# EAGLE design BlinkyTile (EAGLE 7.1.0)
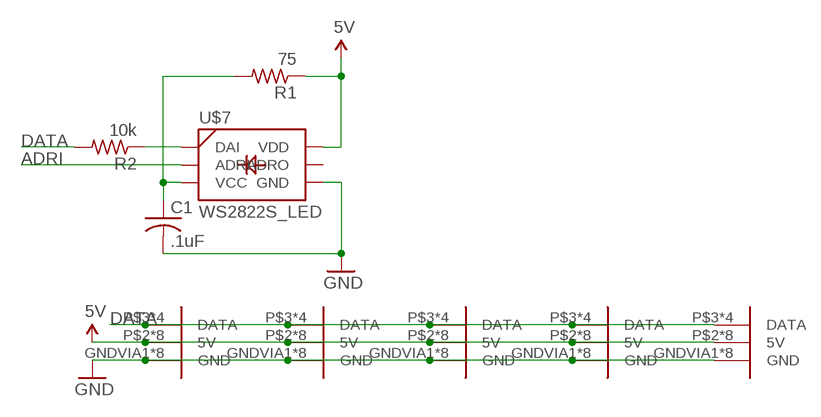
[diagram p0: schematic, sheet 1]

## Parts
C1  .1uF  C-USC0603  [C0603]
R1  75  R-US_R0603  [R0603]
R2  10k  R-US_R0603  [R0603]
U$2  D_EDGEMOD  [D_EDGE_SLOT_MOD]
U$3  D_EDGEMOD  [D_EDGE_SLOT_MOD]
U$4  D_EDGEMOD  [D_EDGE_SLOT_MOD]
U$5  D_EDGEMOD  [D_EDGE_SLOT_MOD]
U$6  D_EDGEMOD  [D_EDGE_SLOT_MOD]
U$7  WS2822S_LED  [WS2822S_LED]

## Nets
5V: R1.1 U$2.P$2(5V) U$2.P$4(5V) U$2.P$7(5V) U$2.P$9(5V) U$2.PWRVIA1(5V) U$2.PWRVIA3(5V) U$2.PWRVIA4(5V) U$2.PWRVIA6(5V) U$3.P$2(5V) U$3.P$4(5V) U$3.P$7(5V) U$3.P$9(5V) U$3.PWRVIA1(5V) U$3.PWRVIA3(5V) U$3.PWRVIA4(5V) U$3.PWRVIA6(5V) U$4.P$2(5V) U$4.P$4(5V) U$4.P$7(5V) U$4.P$9(5V) U$4.PWRVIA1(5V) U$4.PWRVIA3(5V) U$4.PWRVIA4(5V) U$4.PWRVIA6(5V) U$5.P$2(5V) U$5.P$4(5V) U$5.P$7(5V) U$5.P$9(5V) U$5.PWRVIA1(5V) U$5.PWRVIA3(5V) U$5.PWRVIA4(5V) U$5.PWRVIA6(5V) U$6.P$2(5V) U$6.P$4(5V) U$6.P$7(5V) U$6.P$9(5V) U$6.PWRVIA1(5V) U$6.PWRVIA3(5V) U$6.PWRVIA4(5V) U$6.PWRVIA6(5V) U$7.6(VDD)
ADRI: U$7.2(ADRI)
DATA: R2.2 U$2.P$3(DATA) U$2.P$8(DATA) U$2.SIGVIA1(DATA) U$2.SIGVIA3(DATA) U$3.P$3(DATA) U$3.P$8(DATA) U$3.SIGVIA1(DATA) U$3.SIGVIA3(DATA) U$4.P$3(DATA) U$4.P$8(DATA) U$4.SIGVIA1(DATA) U$4.SIGVIA3(DATA) U$5.P$3(DATA) U$5.P$8(DATA) U$5.SIGVIA1(DATA) U$5.SIGVIA3(DATA) U$6.P$3(DATA) U$6.P$8(DATA) U$6.SIGVIA1(DATA) U$6.SIGVIA3(DATA)
GND: C1.2 U$2.GNDVIA1(GND) U$2.GNDVIA3(GND) U$2.GNDVIA4(GND) U$2.GNDVIA6(GND) U$2.P$1(GND) U$2.P$5(GND) U$2.P$6(GND) U$2.P$10(GND) U$3.GNDVIA1(GND) U$3.GNDVIA3(GND) U$3.GNDVIA4(GND) U$3.GNDVIA6(GND) U$3.P$1(GND) U$3.P$5(GND) U$3.P$6(GND) U$3.P$10(GND) U$4.GNDVIA1(GND) U$4.GNDVIA3(GND) U$4.GNDVIA4(GND) U$4.GNDVIA6(GND) U$4.P$1(GND) U$4.P$5(GND) U$4.P$6(GND) U$4.P$10(GND) U$5.GNDVIA1(GND) U$5.GNDVIA3(GND) U$5.GNDVIA4(GND) U$5.GNDVIA6(GND) U$5.P$1(GND) U$5.P$5(GND) U$5.P$6(GND) U$5.P$10(GND) U$6.GNDVIA1(GND) U$6.GNDVIA3(GND) U$6.GNDVIA4(GND) U$6.GNDVIA6(GND) U$6.P$1(GND) U$6.P$5(GND) U$6.P$6(GND) U$6.P$10(GND) U$7.4(GND)
N$1: C1.1 R1.2 U$7.3(VCC)
N$2: R2.1 U$7.1(DAI)
Unconnected: U$7.5(ADRO)

## Library data of the parts
C1 = adafruit:C-US: CAPACITOR, American symbol
R1 R2 = adafruit:R-US_: RESISTOR, American symbol
U$2-U$6 = dodocohedreled:D_EDGE
U$7 = blinkinlabs:WS2822S_LED

## Board
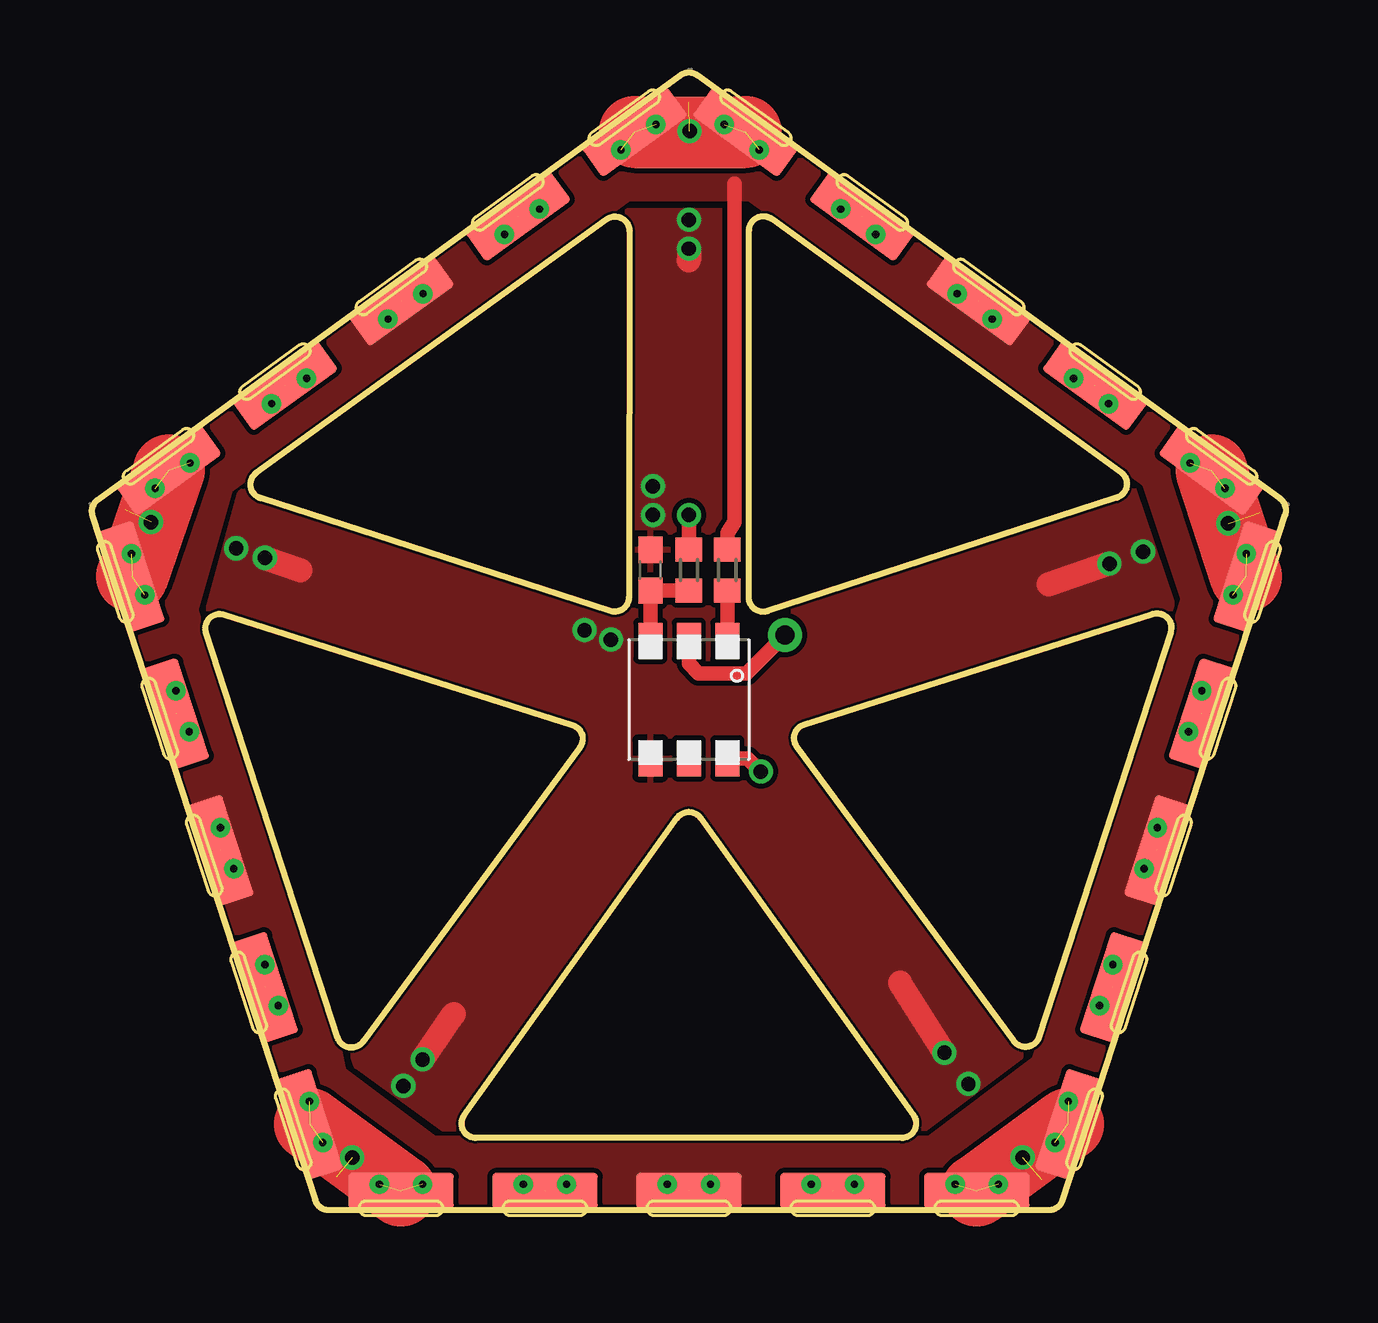
[diagram p1: board, top side]
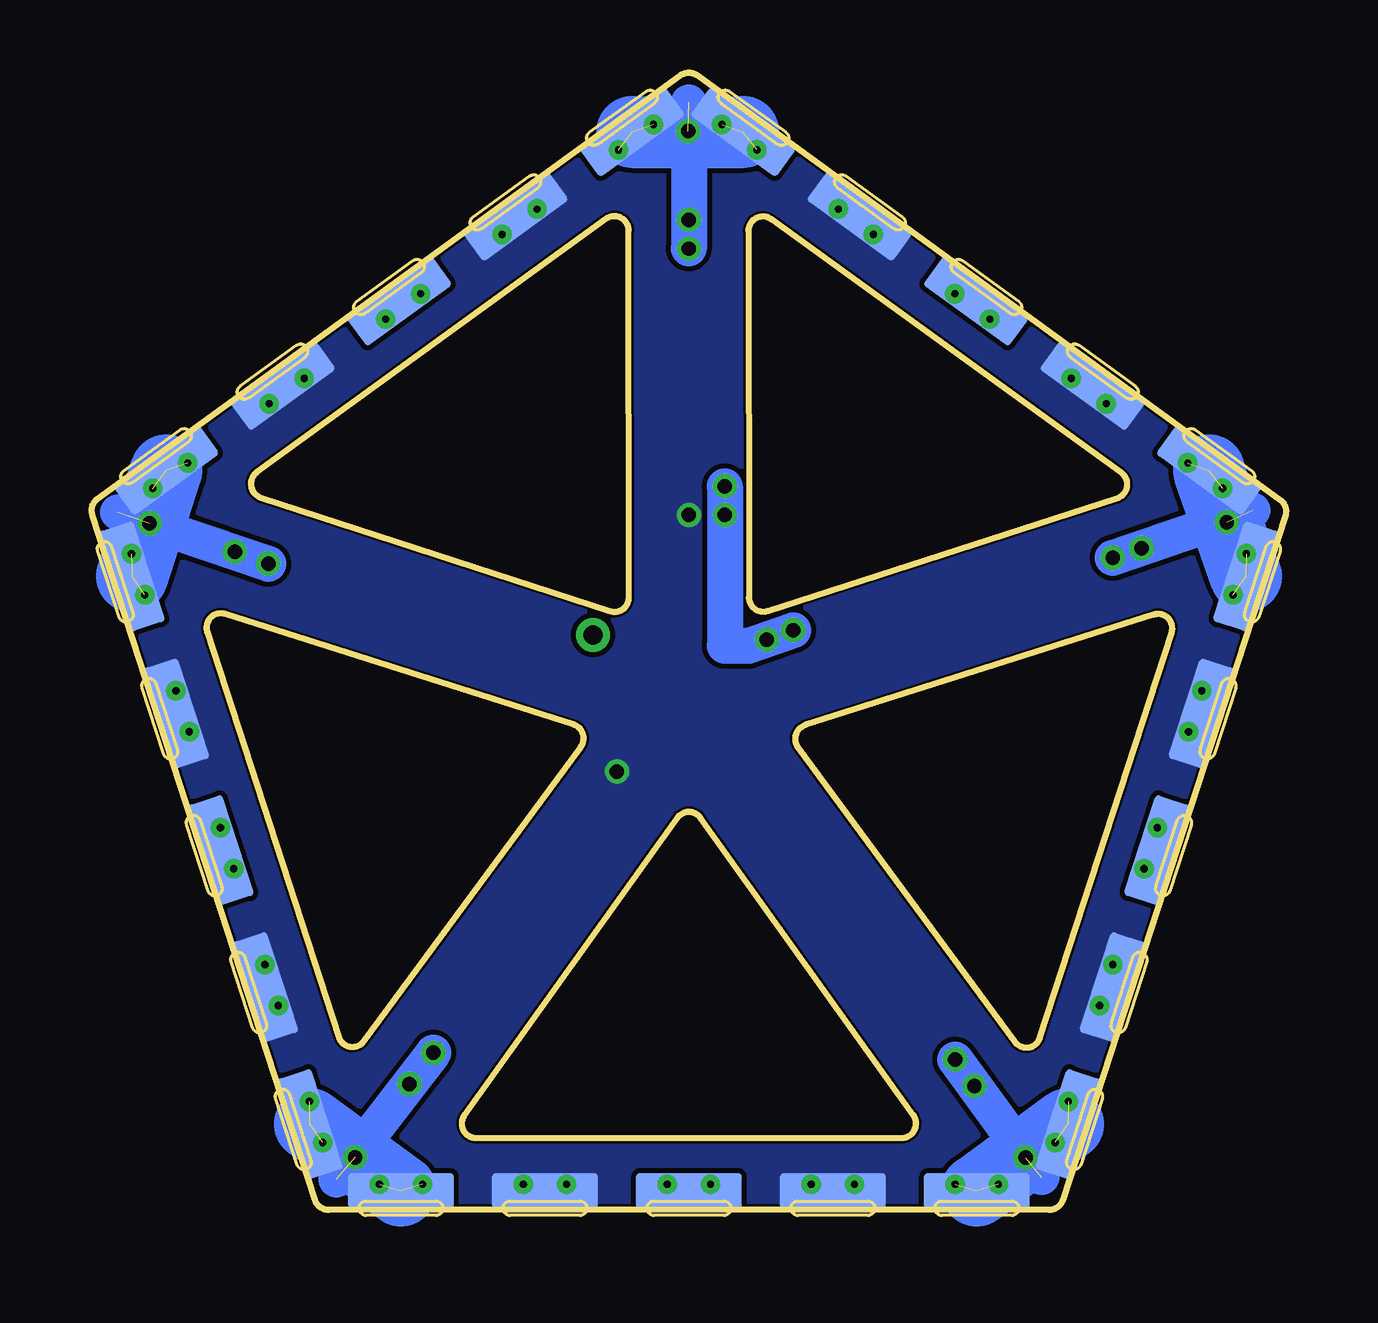
[diagram p2: board, bottom side, seen from below]

Size 49.79 x 47.41 mm. Coordinates in mm from the lower left corner, seen from the top.
Outline: 0.03,28.93 9.31,0.41 arc72 9.88,0 39.91,0 arc72 40.48,0.41 49.76,28.98 arc72 49.54,29.65 25.25,47.29 arc72 24.54,47.29 0.25,29.6 arc72 0.03,28.93
Outline: 15.53,3.95 24.41,16.34 arc-109 25.38,16.34 34.25,3.95 arc-126 33.77,3 16.02,3 arc-126 15.53,3.95
Outline: 38.44,7.04 29.4,19.3 arc-109 29.7,20.23 44.22,24.84 arc-126 44.97,24.08 39.49,7.21 arc-126 38.44,7.04
Outline: 5.52,24.81 20.05,20.2 arc-109 20.35,19.28 11.31,7.01 arc-126 10.25,7.18 4.77,24.06 arc-126 5.52,24.81
Outline: 22.41,40.81 22.39,25.54 arc-108 21.61,24.96 7.04,29.67 arc-126 6.87,30.73 21.46,41.3 arc-126 22.41,40.81
Outline: 42.74,29.69 28.18,24.96 arc-108 27.39,25.53 27.4,40.82 arc-126 28.35,41.31 42.9,30.75 arc-126 42.74,29.69
Copper layers (1*16): Top 0.035mm / dielectric 1.5mm / Bottom 0.035mm
Design rules "default *": minimum track width 10mil, minimum drill 0.6mm, track to track 8mil, track to pad 8mil, pad to pad 8mil, via to via 8mil, smd to smd 8mil, copper to edge 0.1mm, drill to drill 8mil, minimum pad ring 10mil, minimum via ring 8mil, stop-mask expansion 4mil, vias tented up to drill 0.6mm, thermal gap 10mil

### Footprints (pad centres in the part's own frame; a part is rotated, then mirrored left to right if it is on the bottom)
C0603 = smd 1.1 x 1: 1 -0.85,0; 2 0.85,0
R0603 = smd 1 x 1.1: 1 -0.85,0; 2 0.85,0
D_EDGE_SLOT_MOD = drill 0.3: GNDVIA1 -12.9,1; GNDVIA3 -11.1,1; GNDVIA4 11.1,1; GNDVIA6 12.9,1; PWRVIA1 -6.9,1; PWRVIA3 -5.1,1; PWRVIA4 5.1,1; PWRVIA6 6.9,1; SIGVIA1 -0.9,1; SIGVIA3 0.9,1 | smd 4.4 x 1.5: P$1 -12,0.73; P$2 -6,0.73; P$3 0,0.73; P$4 6,0.73; P$5 12,0.73 | smd 4.4 x 1.5 bottom: P$6 -12,0.73; P$7 -6,0.73; P$8 0,0.73; P$9 6,0.73; P$10 12,0.73
WS2822S_LED = smd 1.5 x 1: 1 -2.45,1.6; 2 -2.45,0; 3 -2.45,-1.6; 4 2.45,-1.6; 5 2.45,0; 6 2.45,1.6

### Placement (x,y rotation side)
C1  23.29,26.67 90 top
R1  24.89,26.67 270 top
R2  26.49,26.67 90 top
U$2  24.89,0.07 0 top
U$3  45.09,14.77 72 top
U$4  4.69,14.77 288 top
U$5  37.39,38.47 144 top
U$6  12.49,38.47 216 top
U$7  24.89,21.27 270 top

### Tracks (layer width: path | path; a pad name or v marks a point on that pad's centre or on a via)
5V  (via drill 0.6)  (10 unrouted)
  Top 0.61: U$7.6 27.34,18.82 v27.89,18.27 | R1.1 v24.89,28.97
  pour Bottom: 9.44,0 -0.11,29.39 24.89,47.55 49.89,29.39 40.34,0
ADRI  (via drill 0.8 pad 1.42)
  Top 0.61: U$7.2 24.89,22.77 25.29,22.37 27.29,22.37 v28.89,23.97
DATA  (5 unrouted)
  Top 0.61: R2.2 26.49,28.22 26.79,28.67 26.79,42.77
  pour Top: 9.49,0.07 40.39,-0.03 49.89,29.37 24.89,47.57 -0.11,29.27 7.59,5.57 10.32,6.75 4.34,25.01 5.78,30.03 22.39,42.17 27.39,42.17 43.89,30.27 45.49,25.47 39.29,6.27 34.89,2.97 14.29,2.97 10.29,5.97 7.89,4.67
GND  (via drill 0.6)  (30 unrouted)
  Top 1: v24.89,40.07 24.89,39.57 | v42.42,26.94 39.89,26.07 | v35.54,6.55 33.69,9.47 | v13.79,6.27 15.09,8.17 | v7.22,27.18 8.69,26.67
  Top 3: U$6.P$6 U$5.P$10 | U$6.P$10 U$4.P$6 | U$4.P$10 U$2.P$6 | U$2.P$10 U$3.P$6 | U$5.P$6 U$3.P$10
  Bottom 1: U$6.P$6 24.89,46.17 | U$5.P$6 48.69,29.07 | U$2.P$10 39.59,1.27 | U$2.P$6 10.19,1.37 | U$6.P$10 1.39,29.17
  Bottom 1.5: 24.89,46.17 v24.89,40.07 | 48.69,29.07 v42.42,26.94 | 39.59,1.27 v35.54,6.55 | 10.19,1.37 v13.79,6.27 | 1.39,29.17 v7.22,27.18 | v23.39,30.17 23.39,23.52 22.39,23.52 v20.54,24.17
  Bottom 3: U$4.P$10 U$2.P$6 | U$2.P$10 U$3.P$6 | U$3.P$10 U$5.P$6 | U$5.P$10 U$6.P$6 | U$4.P$6 U$6.P$10
  other vias: 24.89,41.27 43.82,27.44 36.54,5.25 12.99,5.17 6.02,27.58 10.86,2.18 2.47,28.67 24.92,44.97 47.37,28.62 38.8,2.19 21.64,23.77 23.39,28.97
  pour Top: 11.04,6 4.79,24.76 6.19,29.88 22.39,41.67 27.39,41.65 43.39,30.07 45.01,25.27 38.69,6.37 34.74,3.4 14.69,3.37
N$1
  Top 0.61: R1.2 C1.1 U$7.3
N$2
  Top 0.61: R2.1 U$7.1
N$4
  pour Top: 7.89,7.27 10.04,7.98 10.54,5.48 8.39,3.77